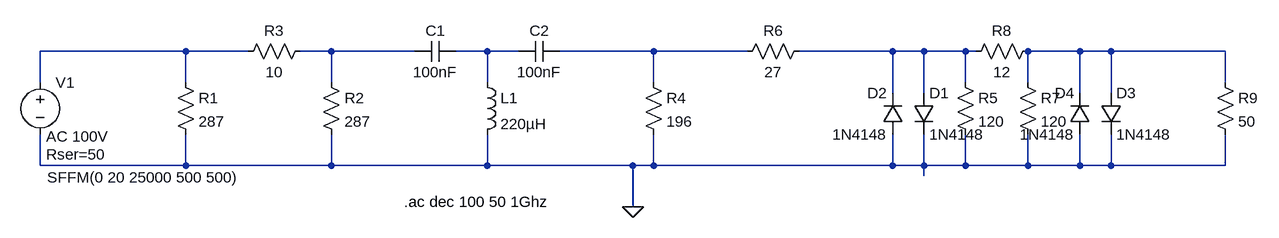
[diagram p0: schematic Transient limiter.asc]
Transient limiter.asc, the LTspice schematic file:
Version 4
SHEET 1 1576 680
WIRE -80 80 -304 80
WIRE 16 80 -80 80
WIRE 144 80 96 80
WIRE 272 80 144 80
WIRE 384 80 336 80
WIRE 432 80 384 80
WIRE 640 80 496 80
WIRE 784 80 640 80
WIRE 1008 80 864 80
WIRE 1056 80 1008 80
WIRE 1120 80 1056 80
WIRE 1136 80 1120 80
WIRE 1296 80 1216 80
WIRE 1344 80 1296 80
WIRE 1520 80 1344 80
WIRE -304 128 -304 80
WIRE -80 128 -80 80
WIRE 144 128 144 80
WIRE 384 128 384 80
WIRE 640 128 640 80
WIRE 1120 128 1120 80
WIRE 1216 128 1216 80
WIRE 1520 128 1520 80
WIRE 1008 144 1008 80
WIRE 1056 144 1056 80
WIRE 1296 144 1296 80
WIRE 1344 144 1344 80
WIRE -304 256 -304 208
WIRE -80 256 -80 208
WIRE -80 256 -304 256
WIRE 144 256 144 208
WIRE 144 256 -80 256
WIRE 384 256 384 208
WIRE 384 256 144 256
WIRE 608 256 384 256
WIRE 640 256 640 208
WIRE 640 256 608 256
WIRE 1008 256 1008 208
WIRE 1008 256 640 256
WIRE 1056 256 1056 208
WIRE 1056 256 1008 256
WIRE 1120 256 1120 208
WIRE 1120 256 1056 256
WIRE 1216 256 1216 208
WIRE 1216 256 1120 256
WIRE 1296 256 1296 208
WIRE 1296 256 1216 256
WIRE 1344 256 1344 208
WIRE 1344 256 1296 256
WIRE 1520 256 1520 208
WIRE 1520 256 1344 256
WIRE 1056 272 1056 256
WIRE 608 320 608 256
FLAG 608 320 0
DATAFLAG 976 256 ""
DATAFLAG 944 80 ""
SYMBOL res -96 112 R0
SYMATTR InstName R1
SYMATTR Value 287
SYMBOL res 128 112 R0
SYMATTR InstName R2
SYMATTR Value 287
SYMBOL res 112 64 R90
WINDOW 0 0 56 VBottom 2
WINDOW 3 32 56 VTop 2
SYMATTR InstName R3
SYMATTR Value 10
SYMBOL cap 336 64 R90
WINDOW 0 0 32 VBottom 2
WINDOW 3 32 32 VTop 2
SYMATTR InstName C1
SYMATTR Value 100nF
SYMBOL cap 496 64 R90
WINDOW 0 0 32 VBottom 2
WINDOW 3 32 32 VTop 2
SYMATTR InstName C2
SYMATTR Value 100nF
SYMBOL ind 368 112 R0
SYMATTR InstName L1
SYMATTR Value 220µH
SYMBOL res 624 112 R0
SYMATTR InstName R4
SYMATTR Value 196
SYMBOL res 768 96 R270
WINDOW 0 32 56 VTop 2
WINDOW 3 0 56 VBottom 2
SYMATTR InstName R6
SYMATTR Value 27
SYMBOL diode 1040 144 R0
SYMATTR InstName D1
SYMATTR Value 1N4148
SYMBOL diode 1024 208 R180
WINDOW 0 24 64 Left 2
WINDOW 3 24 0 Left 2
SYMATTR InstName D2
SYMATTR Value 1N4148
SYMBOL diode 1328 144 R0
SYMATTR InstName D3
SYMATTR Value 1N4148
SYMBOL diode 1312 208 R180
WINDOW 0 24 64 Left 2
WINDOW 3 24 0 Left 2
SYMATTR InstName D4
SYMATTR Value 1N4148
SYMBOL res 1104 112 R0
SYMATTR InstName R5
SYMATTR Value 120
SYMBOL res 1200 112 R0
SYMATTR InstName R7
SYMATTR Value 120
SYMBOL res 1232 64 R90
WINDOW 0 0 56 VBottom 2
WINDOW 3 32 56 VTop 2
SYMATTR InstName R8
SYMATTR Value 12
SYMBOL res 1504 112 R0
SYMATTR InstName R9
SYMATTR Value 50
SYMBOL voltage -304 112 R0
WINDOW 123 9 99 Left 2
WINDOW 39 9 127 Left 2
WINDOW 3 11 162 Left 2
SYMATTR Value2 AC 100V
SYMATTR SpiceLine Rser=50
SYMATTR Value SFFM(0 20 25000 500 500)
SYMATTR InstName V1
TEXT 256 312 Left 2 !.ac dec 100 50 1Ghz

The netlist it stands for:
* Transient limiter.asc
R1 N001 0 287
R2 N002 0 287
R3 N002 N001 10
C1 N003 N002 100nF
C2 N004 N003 100nF
L1 N003 0 220µH
R4 N004 0 196
R6 N004 N005 27
D1 N005 0 1N4148
D2 0 N005 1N4148
D3 N006 0 1N4148
D4 0 N006 1N4148
R5 N005 0 120
R7 N006 0 120
R8 N006 N005 12
R9 N006 0 50
V1 N001 0 SFFM(0 20 25000 500 500) AC 100V Rser=50
.model D D
.lib standard.dio
.ac dec 100 50 1Ghz
.backanno
.end